# EAGLE design HexTo7seg (EAGLE 9.6.2)
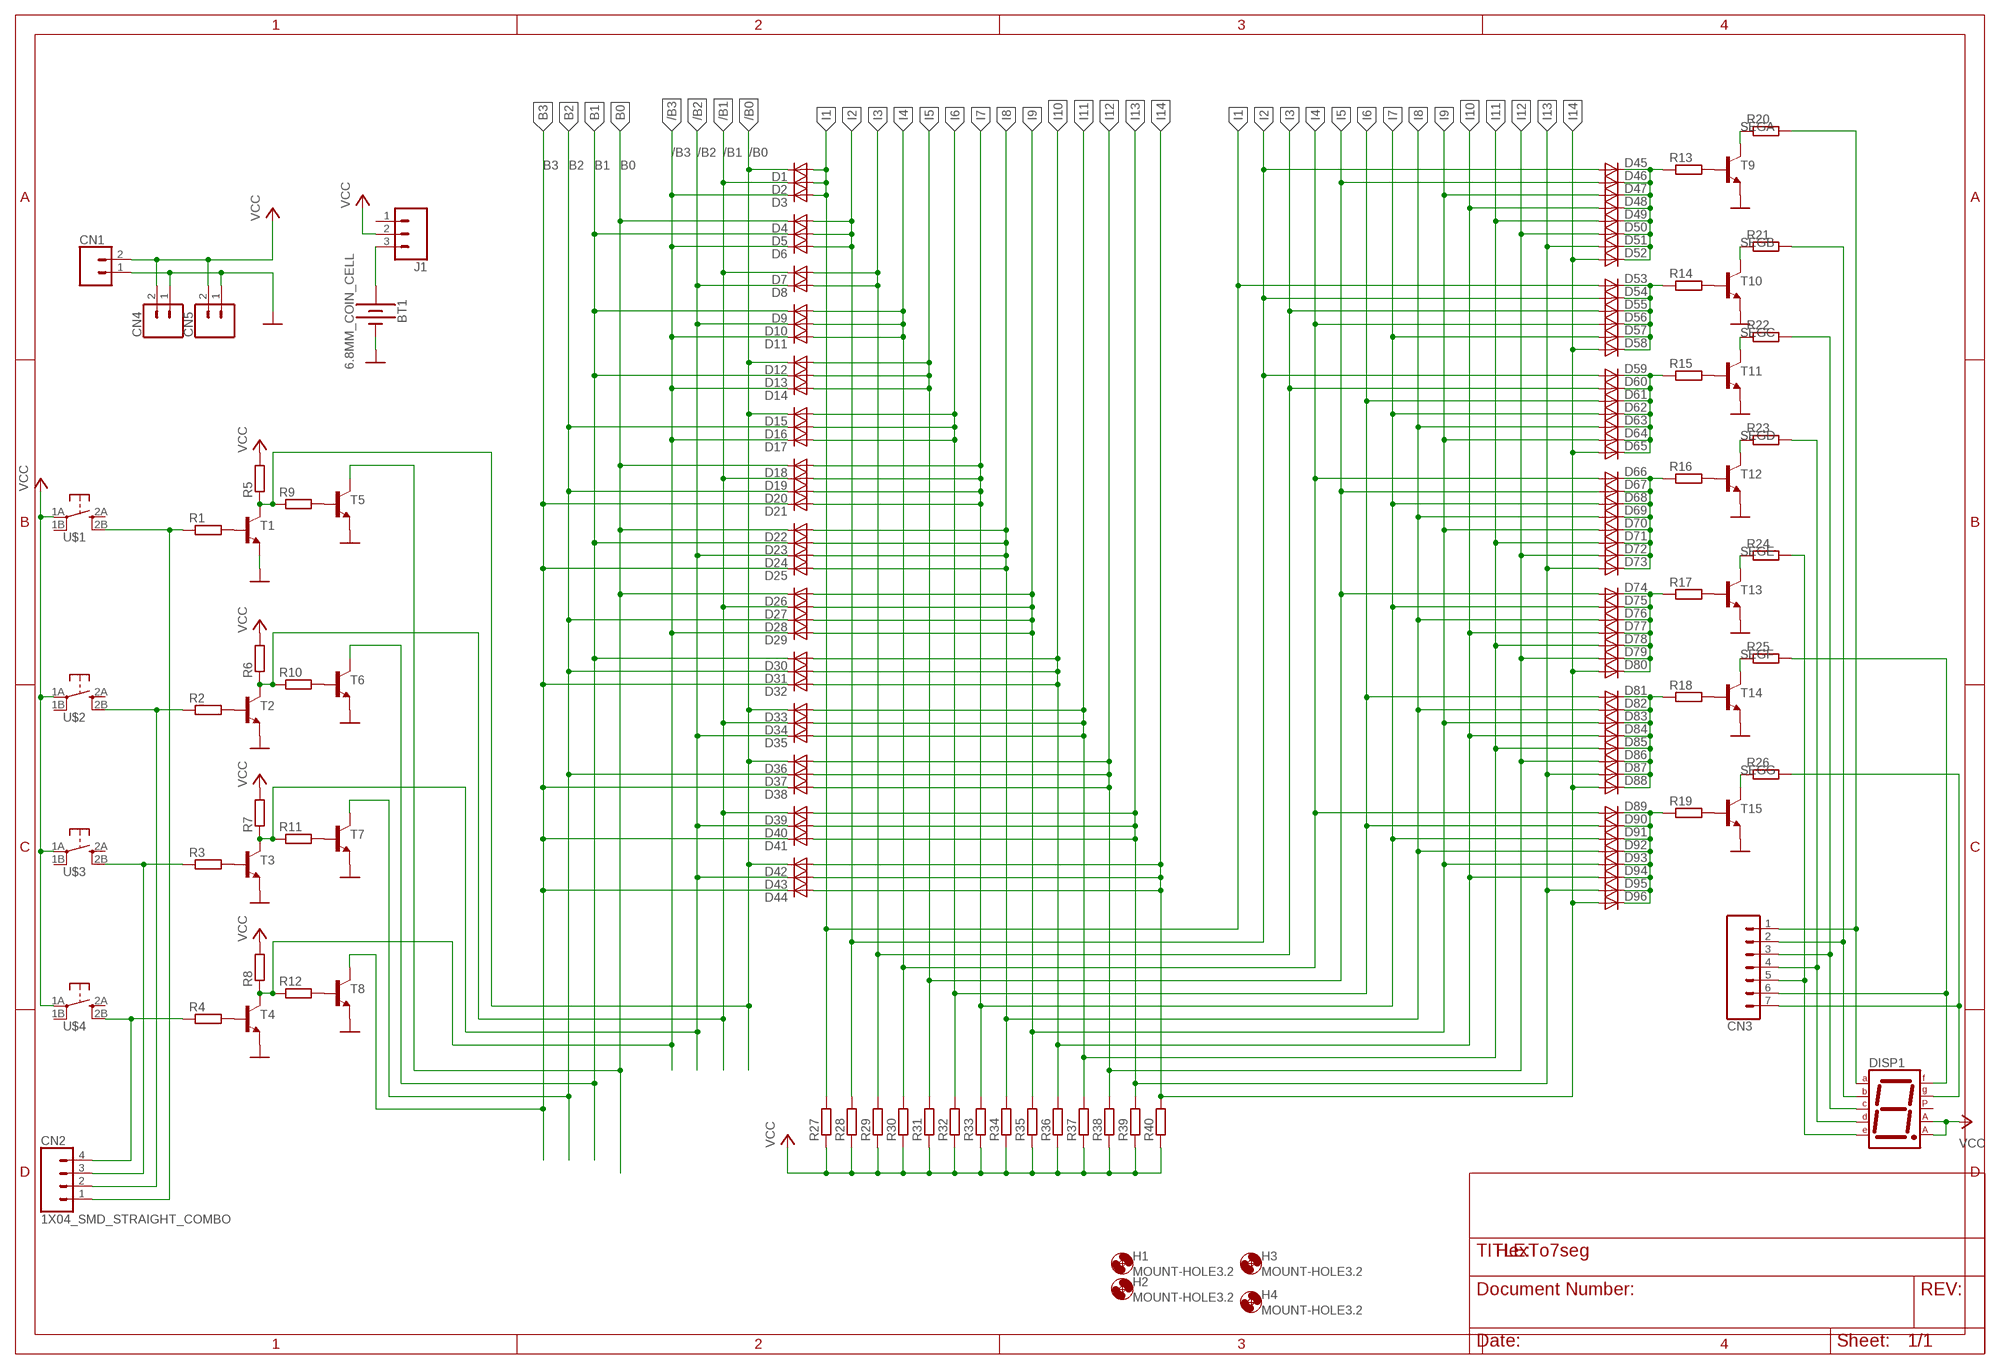
[diagram p0: schematic, sheet 1]

## Parts
BT1  6.8MM_COIN_CELL  BATTERY-20MM_PTH  [BATTCOM_20MM_PTH]
CN1  CONN_02  [1X02]
CN2  1X04_SMD_STRAIGHT_COMBO  CONN_04  [1X04]
CN3  CONN_07  [1X07]
CN4  CONN_02  [1X02]
CN5  CONN_02  [1X02]
D1  SMALL_DIODEDO35-7  [DO35-7]
D2  SMALL_DIODEDO35-7  [DO35-7]
D3  SMALL_DIODEDO35-7  [DO35-7]
D4  SMALL_DIODEDO35-7  [DO35-7]
D5  SMALL_DIODEDO35-7  [DO35-7]
D6  SMALL_DIODEDO35-7  [DO35-7]
D7  SMALL_DIODEDO35-7  [DO35-7]
D8  SMALL_DIODEDO35-7  [DO35-7]
D9  SMALL_DIODEDO35-7  [DO35-7]
D10  SMALL_DIODEDO35-7  [DO35-7]
D11  SMALL_DIODEDO35-7  [DO35-7]
D12  SMALL_DIODEDO35-7  [DO35-7]
D13  SMALL_DIODEDO35-7  [DO35-7]
D14  SMALL_DIODEDO35-7  [DO35-7]
D15  SMALL_DIODEDO35-7  [DO35-7]
D16  SMALL_DIODEDO35-7  [DO35-7]
D17  SMALL_DIODEDO35-7  [DO35-7]
D18  SMALL_DIODEDO35-7  [DO35-7]
D19  SMALL_DIODEDO35-7  [DO35-7]
D20  SMALL_DIODEDO35-7  [DO35-7]
D21  SMALL_DIODEDO35-7  [DO35-7]
D22  SMALL_DIODEDO35-7  [DO35-7]
D23  SMALL_DIODEDO35-7  [DO35-7]
D24  SMALL_DIODEDO35-7  [DO35-7]
D25  SMALL_DIODEDO35-7  [DO35-7]
D26  SMALL_DIODEDO35-7  [DO35-7]
D27  SMALL_DIODEDO35-7  [DO35-7]
D28  SMALL_DIODEDO35-7  [DO35-7]
D29  SMALL_DIODEDO35-7  [DO35-7]
D30  SMALL_DIODEDO35-7  [DO35-7]
D31  SMALL_DIODEDO35-7  [DO35-7]
D32  SMALL_DIODEDO35-7  [DO35-7]
D33  SMALL_DIODEDO35-7  [DO35-7]
D34  SMALL_DIODEDO35-7  [DO35-7]
D35  SMALL_DIODEDO35-7  [DO35-7]
D36  SMALL_DIODEDO35-7  [DO35-7]
D37  SMALL_DIODEDO35-7  [DO35-7]
D38  SMALL_DIODEDO35-7  [DO35-7]
D39  SMALL_DIODEDO35-7  [DO35-7]
D40  SMALL_DIODEDO35-7  [DO35-7]
D41  SMALL_DIODEDO35-7  [DO35-7]
D42  SMALL_DIODEDO35-7  [DO35-7]
D43  SMALL_DIODEDO35-7  [DO35-7]
D44  SMALL_DIODEDO35-7  [DO35-7]
D45  SMALL_DIODEDO35-7  [DO35-7]
D46  SMALL_DIODEDO35-7  [DO35-7]
D47  SMALL_DIODEDO35-7  [DO35-7]
D48  SMALL_DIODEDO35-7  [DO35-7]
D49  SMALL_DIODEDO35-7  [DO35-7]
D50  SMALL_DIODEDO35-7  [DO35-7]
D51  SMALL_DIODEDO35-7  [DO35-7]
D52  SMALL_DIODEDO35-7  [DO35-7]
D53  SMALL_DIODEDO35-7  [DO35-7]
D54  SMALL_DIODEDO35-7  [DO35-7]
D55  SMALL_DIODEDO35-7  [DO35-7]
D56  SMALL_DIODEDO35-7  [DO35-7]
D57  SMALL_DIODEDO35-7  [DO35-7]
D58  SMALL_DIODEDO35-7  [DO35-7]
D59  SMALL_DIODEDO35-7  [DO35-7]
D60  SMALL_DIODEDO35-7  [DO35-7]
D61  SMALL_DIODEDO35-7  [DO35-7]
D62  SMALL_DIODEDO35-7  [DO35-7]
D63  SMALL_DIODEDO35-7  [DO35-7]
D64  SMALL_DIODEDO35-7  [DO35-7]
D65  SMALL_DIODEDO35-7  [DO35-7]
D66  SMALL_DIODEDO35-7  [DO35-7]
D67  SMALL_DIODEDO35-7  [DO35-7]
D68  SMALL_DIODEDO35-7  [DO35-7]
D69  SMALL_DIODEDO35-7  [DO35-7]
D70  SMALL_DIODEDO35-7  [DO35-7]
D71  SMALL_DIODEDO35-7  [DO35-7]
D72  SMALL_DIODEDO35-7  [DO35-7]
D73  SMALL_DIODEDO35-7  [DO35-7]
D74  SMALL_DIODEDO35-7  [DO35-7]
D75  SMALL_DIODEDO35-7  [DO35-7]
D76  SMALL_DIODEDO35-7  [DO35-7]
D77  SMALL_DIODEDO35-7  [DO35-7]
D78  SMALL_DIODEDO35-7  [DO35-7]
D79  SMALL_DIODEDO35-7  [DO35-7]
D80  SMALL_DIODEDO35-7  [DO35-7]
D81  SMALL_DIODEDO35-7  [DO35-7]
D82  SMALL_DIODEDO35-7  [DO35-7]
D83  SMALL_DIODEDO35-7  [DO35-7]
D84  SMALL_DIODEDO35-7  [DO35-7]
D85  SMALL_DIODEDO35-7  [DO35-7]
D86  SMALL_DIODEDO35-7  [DO35-7]
D87  SMALL_DIODEDO35-7  [DO35-7]
D88  SMALL_DIODEDO35-7  [DO35-7]
D89  SMALL_DIODEDO35-7  [DO35-7]
D90  SMALL_DIODEDO35-7  [DO35-7]
D91  SMALL_DIODEDO35-7  [DO35-7]
D92  SMALL_DIODEDO35-7  [DO35-7]
D93  SMALL_DIODEDO35-7  [DO35-7]
D94  SMALL_DIODEDO35-7  [DO35-7]
D95  SMALL_DIODEDO35-7  [DO35-7]
D96  SMALL_DIODEDO35-7  [DO35-7]
DISP1  7SEG-CA  [7SEG-13]
H1  MOUNT-HOLE3.2  [3,2]
H2  MOUNT-HOLE3.2  [3,2]
H3  MOUNT-HOLE3.2  [3,2]
H4  MOUNT-HOLE3.2  [3,2]
J1  CONN_03NP  [1X03NOSTOP]
R1  RESISTOR7MM  [7MM_RESISTOR]
R2  RESISTOR7MM  [7MM_RESISTOR]
R3  RESISTOR7MM  [7MM_RESISTOR]
R4  RESISTOR7MM  [7MM_RESISTOR]
R5  RESISTOR7MM  [7MM_RESISTOR]
R6  RESISTOR7MM  [7MM_RESISTOR]
R7  RESISTOR7MM  [7MM_RESISTOR]
R8  RESISTOR7MM  [7MM_RESISTOR]
R9  RESISTOR7MM  [7MM_RESISTOR]
R10  RESISTOR7MM  [7MM_RESISTOR]
R11  RESISTOR7MM  [7MM_RESISTOR]
R12  RESISTOR7MM  [7MM_RESISTOR]
R13  RESISTOR7MM  [7MM_RESISTOR]
R14  RESISTOR7MM  [7MM_RESISTOR]
R15  RESISTOR7MM  [7MM_RESISTOR]
R16  RESISTOR7MM  [7MM_RESISTOR]
R17  RESISTOR7MM  [7MM_RESISTOR]
R18  RESISTOR7MM  [7MM_RESISTOR]
R19  RESISTOR7MM  [7MM_RESISTOR]
R20  RESISTOR7MM  [7MM_RESISTOR]
R21  RESISTOR7MM  [7MM_RESISTOR]
R22  RESISTOR7MM  [7MM_RESISTOR]
R23  RESISTOR7MM  [7MM_RESISTOR]
R24  RESISTOR7MM  [7MM_RESISTOR]
R25  RESISTOR7MM  [7MM_RESISTOR]
R26  RESISTOR7MM  [7MM_RESISTOR]
R27  RESISTOR7MM  [7MM_RESISTOR]
R28  RESISTOR7MM  [7MM_RESISTOR]
R29  RESISTOR7MM  [7MM_RESISTOR]
R30  RESISTOR7MM  [7MM_RESISTOR]
R31  RESISTOR7MM  [7MM_RESISTOR]
R32  RESISTOR7MM  [7MM_RESISTOR]
R33  RESISTOR7MM  [7MM_RESISTOR]
R34  RESISTOR7MM  [7MM_RESISTOR]
R35  RESISTOR7MM  [7MM_RESISTOR]
R36  RESISTOR7MM  [7MM_RESISTOR]
R37  RESISTOR7MM  [7MM_RESISTOR]
R38  RESISTOR7MM  [7MM_RESISTOR]
R39  RESISTOR7MM  [7MM_RESISTOR]
R40  RESISTOR7MM  [7MM_RESISTOR]
T1  BC547B-NPN-TO92-CBE  [TO92-CBE]
T2  BC547B-NPN-TO92-CBE  [TO92-CBE]
T3  BC547B-NPN-TO92-CBE  [TO92-CBE]
T4  BC547B-NPN-TO92-CBE  [TO92-CBE]
T5  BC547B-NPN-TO92-CBE  [TO92-CBE]
T6  BC547B-NPN-TO92-CBE  [TO92-CBE]
T7  BC547B-NPN-TO92-CBE  [TO92-CBE]
T8  BC547B-NPN-TO92-CBE  [TO92-CBE]
T9  BC547B-NPN-TO92-CBE  [TO92-CBE]
T10  BC547B-NPN-TO92-CBE  [TO92-CBE]
T11  BC547B-NPN-TO92-CBE  [TO92-CBE]
T12  BC547B-NPN-TO92-CBE  [TO92-CBE]
T13  BC547B-NPN-TO92-CBE  [TO92-CBE]
T14  BC547B-NPN-TO92-CBE  [TO92-CBE]
T15  BC547B-NPN-TO92-CBE  [TO92-CBE]
U$1  TACTILETACT-6X6-PTH  [TACTILE-PTH]
U$2  TACTILETACT-6X6-PTH  [TACTILE-PTH]
U$3  TACTILETACT-6X6-PTH  [TACTILE-PTH]
U$4  TACTILETACT-6X6-PTH  [TACTILE-PTH]

## Nets
/B0: D1.C D12.C D15.C D33.C D36.C D42.C R5.1 R9.1 T1.C
/B1: D2.C D7.C D19.C D27.C D34.C D39.C R6.1 R10.1 T2.C
/B2: D8.C D10.C D24.C D35.C D40.C D43.C R7.1 R11.1 T3.C
/B3: D3.C D6.C D11.C D14.C D17.C D29.C R8.1 R12.1 T4.C
B0: D4.C D18.C D22.C D26.C T5.C
B1: D5.C D9.C D13.C D23.C D30.C T6.C
B2: D16.C D20.C D28.C D31.C D37.C T7.C
B3: D21.C D25.C D32.C D38.C D41.C D44.C T8.C
GND [PWR]: BT1.2(-) CN1.1 CN4.1 CN5.1 T1.E T2.E T3.E T4.E T5.E T6.E T7.E T8.E T9.E T10.E T11.E T12.E T13.E T14.E T15.E
I1: D1.A D2.A D3.A D53.A R27.2
I2: D4.A D5.A D6.A D45.A D54.A D59.A R28.2
I3: D7.A D8.A D55.A D60.A R29.2
I4: D9.A D10.A D11.A D56.A D66.A D89.A R30.2
I5: D12.A D13.A D14.A D46.A D67.A D74.A R31.2
I6: D15.A D16.A D17.A D61.A D81.A D90.A R32.2
I7: D18.A D19.A D20.A D21.A D57.A D62.A D68.A D75.A D91.A R33.2
I8: D22.A D23.A D24.A D25.A D63.A D69.A D76.A D82.A D92.A R34.2
I9: D26.A D27.A D28.A D29.A D47.A D64.A D70.A D83.A D93.A R35.2
I10: D30.A D31.A D32.A D48.A D77.A D84.A D94.A R36.2
I11: D33.A D34.A D35.A D49.A D71.A D78.A D85.A R37.2
I12: D36.A D37.A D38.A D50.A D72.A D79.A D86.A R38.2
I13: D39.A D40.A D41.A D51.A D73.A D87.A D95.A R39.2
I14: D42.A D43.A D44.A D52.A D58.A D65.A D80.A D88.A D96.A R40.2
IN0: CN2.1 R1.1 U$1.2B
IN1: CN2.2 R2.1 U$2.2B
IN2: CN2.3 R3.1 U$3.2B
IN3: CN2.4 R4.1 U$4.2B
N$1: R13.2 T9.B
N$2: CN3.1 DISP1.7(A) R20.2
N$3: R14.2 T10.B
N$4: R15.2 T11.B
N$5: R16.2 T12.B
N$6: R17.2 T13.B
N$7: R18.2 T14.B
N$8: R19.2 T15.B
N$9: CN3.2 DISP1.6(B) R21.2
N$10: CN3.3 DISP1.4(C) R22.2
N$11: CN3.4 DISP1.2(D) R23.2
N$12: CN3.5 DISP1.1(E) R24.2
N$13: CN3.6 DISP1.9(F) R25.2
N$14: CN3.7 DISP1.10(G) R26.2
N$16 [PWR]: BT1.1(+) J1.3
N$22: R1.2 T1.B
N$23: R2.2 T2.B
N$24: R3.2 T3.B
N$25: R4.2 T4.B
N$26: R12.2 T8.B
N$27: R11.2 T7.B
N$28: R10.2 T6.B
N$29: R9.2 T5.B
ORA: D45.C D46.C D47.C D48.C D49.C D50.C D51.C D52.C R13.1
ORB: D53.C D54.C D55.C D56.C D57.C D58.C R14.1
ORC: D59.C D60.C D61.C D62.C D63.C D64.C D65.C R15.1
ORD: D66.C D67.C D68.C D69.C D70.C D71.C D72.C D73.C R16.1
ORE: D74.C D75.C D76.C D77.C D78.C D79.C D80.C R17.1
ORF: D81.C D82.C D83.C D84.C D85.C D86.C D87.C D88.C R18.1
ORG: D89.C D90.C D91.C D92.C D93.C D94.C D95.C D96.C R19.1
SEGA: R20.1 T9.C
SEGB: R21.1 T10.C
SEGC: R22.1 T11.C
SEGD: R23.1 T12.C
SEGE: R24.1 T13.C
SEGF: R25.1 T14.C
SEGG: R26.1 T15.C
VCC [PWR]: CN1.2 CN4.2 CN5.2 DISP1.3(CA1) DISP1.8(CA2) J1.2 R5.2 R6.2 R7.2 R8.2 R27.1 R28.1 R29.1 R30.1 R31.1 R32.1 R33.1 R34.1 R35.1 R36.1 R37.1 R38.1 R39.1 R40.1 U$1.1A U$2.1A U$3.1A U$4.1A
Unconnected: DISP1.5(DP) J1.1 U$1.1B U$1.2A U$2.1B U$2.2A U$3.1B U$3.2A U$4.1B U$4.2A

## Library data of the parts
BT1 = MatsEng:BATTERY: Battery - Single Cell A variety of battery chemistries, sizes, and footprints. Device List: 20MM_PTH - Coin Cell Battery Holder - 20mm (PTH) <https://www.sparkfun.com/products/783> 6.8MM_PTH - Coin Cell Battery Holder - 6.8MM(SMD) <https://www.digikey.com/product-detail/en/seiko-instruments/MS621FE-FL11E/728-1057-ND/1889208?WT.srch=1&gclid=CNOQ5a6LzdQCFZS2wAodXCkE0g> 12MM_SMD - Coin Cell Battery Holder - 12mm (SMD) <https://www.sparkfun.com/products/10592> 12MM_PTH - Coin Cell Battery Holder - 12mm (PTH) <https://www.sparkfun.com/products/7948> 20MM_SMD - 20mm Coin Cell Battery Holder (SMD) (2 legs) Used on the Big Time Watch Kit <https://www.sparkfun.com/products/11734> 20MM_SMD_4LEGS - Coin Cell Battery Holder - 20mm (SMD) <https://www.sparkfun.com/products/11892> 20MM_SMD_4LEGS_OVERPASTE - Coin Cell Battery Holder - 20mm (SMD) <https://www.sparkfun.com/products/11892> (Over-paste on the legs) 24.5MM_PTH - Coin Cell Battery Holder - 24.5mm (PTH) <https://www.sparkfun.com/products/8863> 9V - 9V Battery Holder - PC Mount Used on the SparkFun SparkPunk Sound Kit <https://www.sparkfun.com/products/11177> and SparkFun SparkPunk Sequencer Kit <https://www.sparkfun.com/products/12707> 18650 - Battery Holder - 18650 (PTH) <https://www.sparkfun.com/products/13113> AA - Battery Holder - 1xAA (PTH) <https://www.sparkfun.com/products/7949> AAA - Battery Holder - 1xAAA (PTH) <https://www.sparkfun.com/products/12718> AA_KIT - Battery Holder - 1xAA (PTH) <https://www.sparkfun.com/products/7949> Special kit package - pads only have exposed copper on one side of the board. AAA_KIT - Battery Holder - 1xAAA (PTH) <https://www.sparkfun.com/products/12718> Special kit package - pads only have exposed copper on one side of the board.; PROD_ID: BATT-08316; SF_SKU: PRT-07949
CN1 CN4 CN5 = MatsEng:CONN_02: Multi connection point. Often used as Generic Header-pin footprint for 0.1 inch spaced/style header connections On any of the 0.1 inch spaced packages, you can populate with these: Break Away Headers - Straight <https://www.sparkfun.com/products/116> (PRT-00116) Break Away Male Headers - Right Angle <https://www.sparkfun.com/products/553> (PRT-00553) Female Headers <https://www.sparkfun.com/products/115> (PRT-00115) Break Away Headers - Machine Pin <https://www.sparkfun.com/products/117> (PRT-00117) Break Away Female Headers - Swiss Machine Pin <https://www.sparkfun.com/products/743> (PRT-00743) For SCREWTERMINALS and SPRING TERMINALS visit here: Screw Terimnals on SparkFun.com <https://www.sparkfun.com/search/results?term=Screw+Terminals> (5mm/3.5mm/2.54mm spacing) This device is also useful as a general connection point to wire up your design to another part of your project. Our various solder wires solder well into these plated through hole pads. Hook-Up Wire - Assortment (Stranded, 22 AWG) <https://www.sparkfun.com/products/11375> (PRT-11375) Hook-Up Wire - Assortment (Solid Core, 22 AWG) <https://www.sparkfun.com/products/11367> (PRT-11367) View the entire wire category on our website here <https://www.sparkfun.com/categories/141> Special notes: Molex polarized connector foot print use with: PRT-08233 with associated crimp pins and housings. 2.54_SCREWTERM for use with PRT-10571. 3.5mm Screw Terminal footprints for PRT-08084 5mm Screw Terminal footprints for use with PRT-08432; PROD_ID: CONN-13512; SF_ID: PRT-09918; SF_SKU: PRT-08432; SKU: PRT-09914
CN2 = MatsEng:CONN_04: Multi connection point. Often used as Generic Header-pin footprint for 0.1 inch spaced/style header connections On any of the 0.1 inch spaced packages, you can populate with these: Break Away Headers - Straight <https://www.sparkfun.com/products/116> (PRT-00116) Break Away Male Headers - Right Angle <https://www.sparkfun.com/products/553> (PRT-00553) Female Headers <https://www.sparkfun.com/products/115> (PRT-00115) Break Away Headers - Machine Pin <https://www.sparkfun.com/products/117> (PRT-00117) Break Away Female Headers - Swiss Machine Pin <https://www.sparkfun.com/products/743> (PRT-00743) For SCREWTERMINALS and SPRING TERMINALS visit here: Screw Terimnals on SparkFun.com <https://www.sparkfun.com/search/results?term=Screw+Terminals> (5mm/3.5mm/2.54mm spacing) This device is also useful as a general connection point to wire up your design to another part of your project. Our various solder wires solder well into these plated through hole pads. Hook-Up Wire - Assortment (Stranded, 22 AWG) <https://www.sparkfun.com/products/11375> (PRT-11375) Hook-Up Wire - Assortment (Solid Core, 22 AWG) <https://www.sparkfun.com/products/11367> (PRT-11367) View the entire wire category on our website here <https://www.sparkfun.com/categories/141> Special notes: Molex polarized connector foot print use with SKU : PRT-08231 with associated crimp pins and housings. 1MM SMD Version SKU: PRT-10208; PROD_ID: CONN-08511; SF_ID: PRT-12638
CN3 = MatsEng:CONN_07: Multi connection point. Often used as Generic Header-pin footprint for 0.1 inch spaced/style header connections On any of the 0.1 inch spaced packages, you can populate with these: Break Away Headers - Straight <https://www.sparkfun.com/products/116> (PRT-00116) Break Away Male Headers - Right Angle <https://www.sparkfun.com/products/553> (PRT-00553) Female Headers <https://www.sparkfun.com/products/115> (PRT-00115) Break Away Headers - Machine Pin <https://www.sparkfun.com/products/117> (PRT-00117) Break Away Female Headers - Swiss Machine Pin <https://www.sparkfun.com/products/743> (PRT-00743) For SCREWTERMINALS and SPRING TERMINALS visit here: Screw Terimnals on SparkFun.com <https://www.sparkfun.com/search/results?term=Screw+Terminals> (5mm/3.5mm/2.54mm spacing) This device is also useful as a general connection point to wire up your design to another part of your project. Our various solder wires solder well into these plated through hole pads. Hook-Up Wire - Assortment (Stranded, 22 AWG) <https://www.sparkfun.com/products/11375> (PRT-11375) Hook-Up Wire - Assortment (Solid Core, 22 AWG) <https://www.sparkfun.com/products/11367> (PRT-11367) View the entire wire category on our website here <https://www.sparkfun.com/categories/141> Special notes: Molex polarized connector foot print use with SKU : PRT-08231 with associated crimp pins and housings. 1MM SMD Version SKU: PRT-10208 NOTES ON THE VARIANTS LOCK and LOCK_LONGPADS... This footprint was designed to help hold the alignment of a through-hole component (i.e. 6-pin header) while soldering it into place. You may notice that each hole has been shifted either up or down by 0.005 of an inch from it's more standard position (which is a perfectly straight line). This slight alteration caused the pins (the squares in the middle) to touch the edges of the holes. Because they are alternating, it causes a "brace" to hold the component in place. 0.005 has proven to be the perfect amount of "off-center" position when using our standard breakaway headers. Although looks a little odd when you look at the bare footprint, once you have a header in there, the alteration is very hard to notice. Also,if you push a header all the way into place, it is covered up entirely on the bottom side.
D1-D96 = MatsEng:SMALL_DIODE: Small Signal Diode
DISP1 = MatsEng:7SEG-CA: 7-segment DISPLAY single anode, 13 mm
H1-H4 = MatsEng:MOUNT-HOLE: MOUNTING HOLE with drill center marker
J1 = MatsEng:CONN_03: Multi connection point. Often used as Generic Header-pin footprint for 0.1 inch spaced/style header connections On any of the 0.1 inch spaced packages, you can populate with these: Break Away Headers - Straight <https://www.sparkfun.com/products/116> (PRT-00116) Break Away Male Headers - Right Angle <https://www.sparkfun.com/products/553> (PRT-00553) Female Headers <https://www.sparkfun.com/products/115> (PRT-00115) Break Away Headers - Machine Pin <https://www.sparkfun.com/products/117> (PRT-00117) Break Away Female Headers - Swiss Machine Pin <https://www.sparkfun.com/products/743> (PRT-00743) For SCREWTERMINALS and SPRING TERMINALS visit here: Screw Terimnals on SparkFun.com <https://www.sparkfun.com/search/results?term=Screw+Terminals> (5mm/3.5mm/2.54mm spacing) This device is also useful as a general connection point to wire up your design to another part of your project. Our various solder wires solder well into these plated through hole pads. Hook-Up Wire - Assortment (Stranded, 22 AWG) <https://www.sparkfun.com/products/11375> (PRT-11375) Hook-Up Wire - Assortment (Solid Core, 22 AWG) <https://www.sparkfun.com/products/11367> (PRT-11367) View the entire wire category on our website here <https://www.sparkfun.com/categories/141> Special notes: Molex polarized connector foot print use with SKU : PRT-08231 with associated crimp pins and housings. 1MM SMD Version SKU: PRT-10208
R1-R40 = MatsEng:RESISTOR: Standard resistor, various versions
T1-T15 = MatsEng:*-NPN-: NPN Transistror BF959 corrected 2008.03.06
U$1-U$4 = MatsEng:TACTILE

## Net classes
0 default: width 0.305 mm, drill 0.4 mm, clearance 0.203 mm
1 PWR: width 0.61 mm, drill 0.4 mm, clearance 0.203 mm

## Board
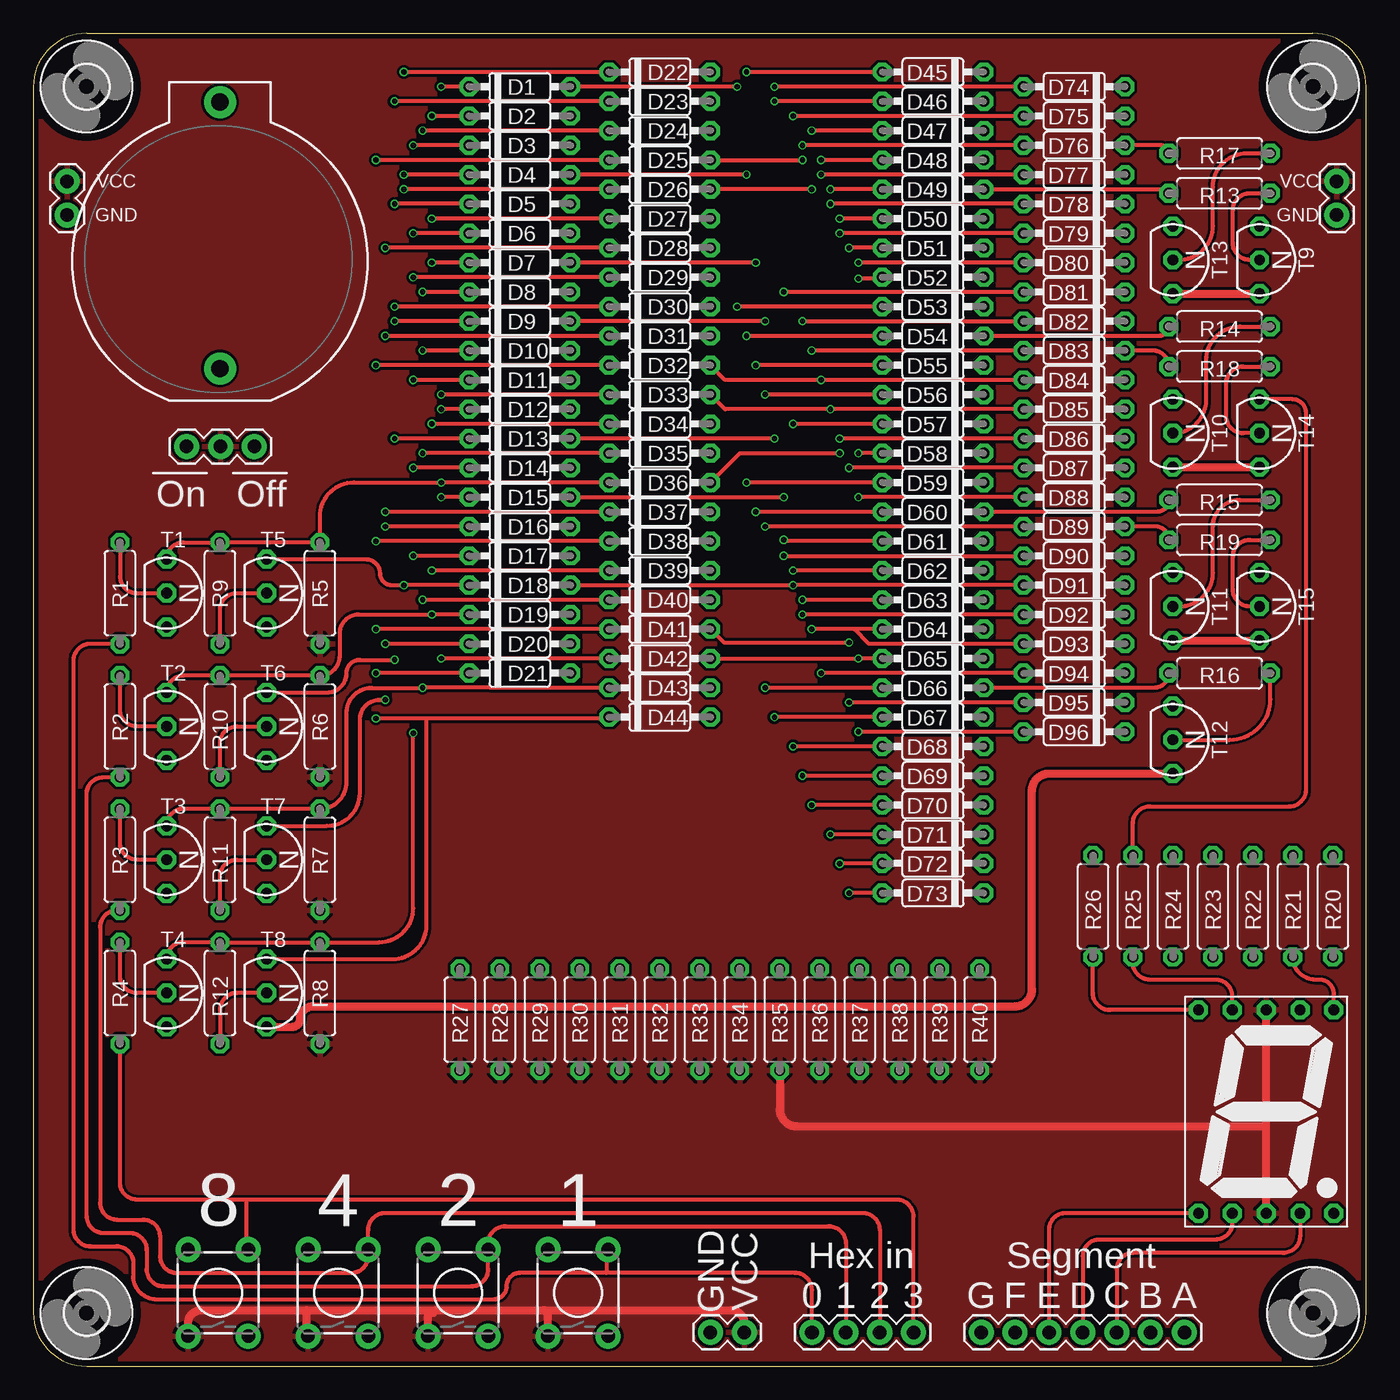
[diagram p1: board, top side]
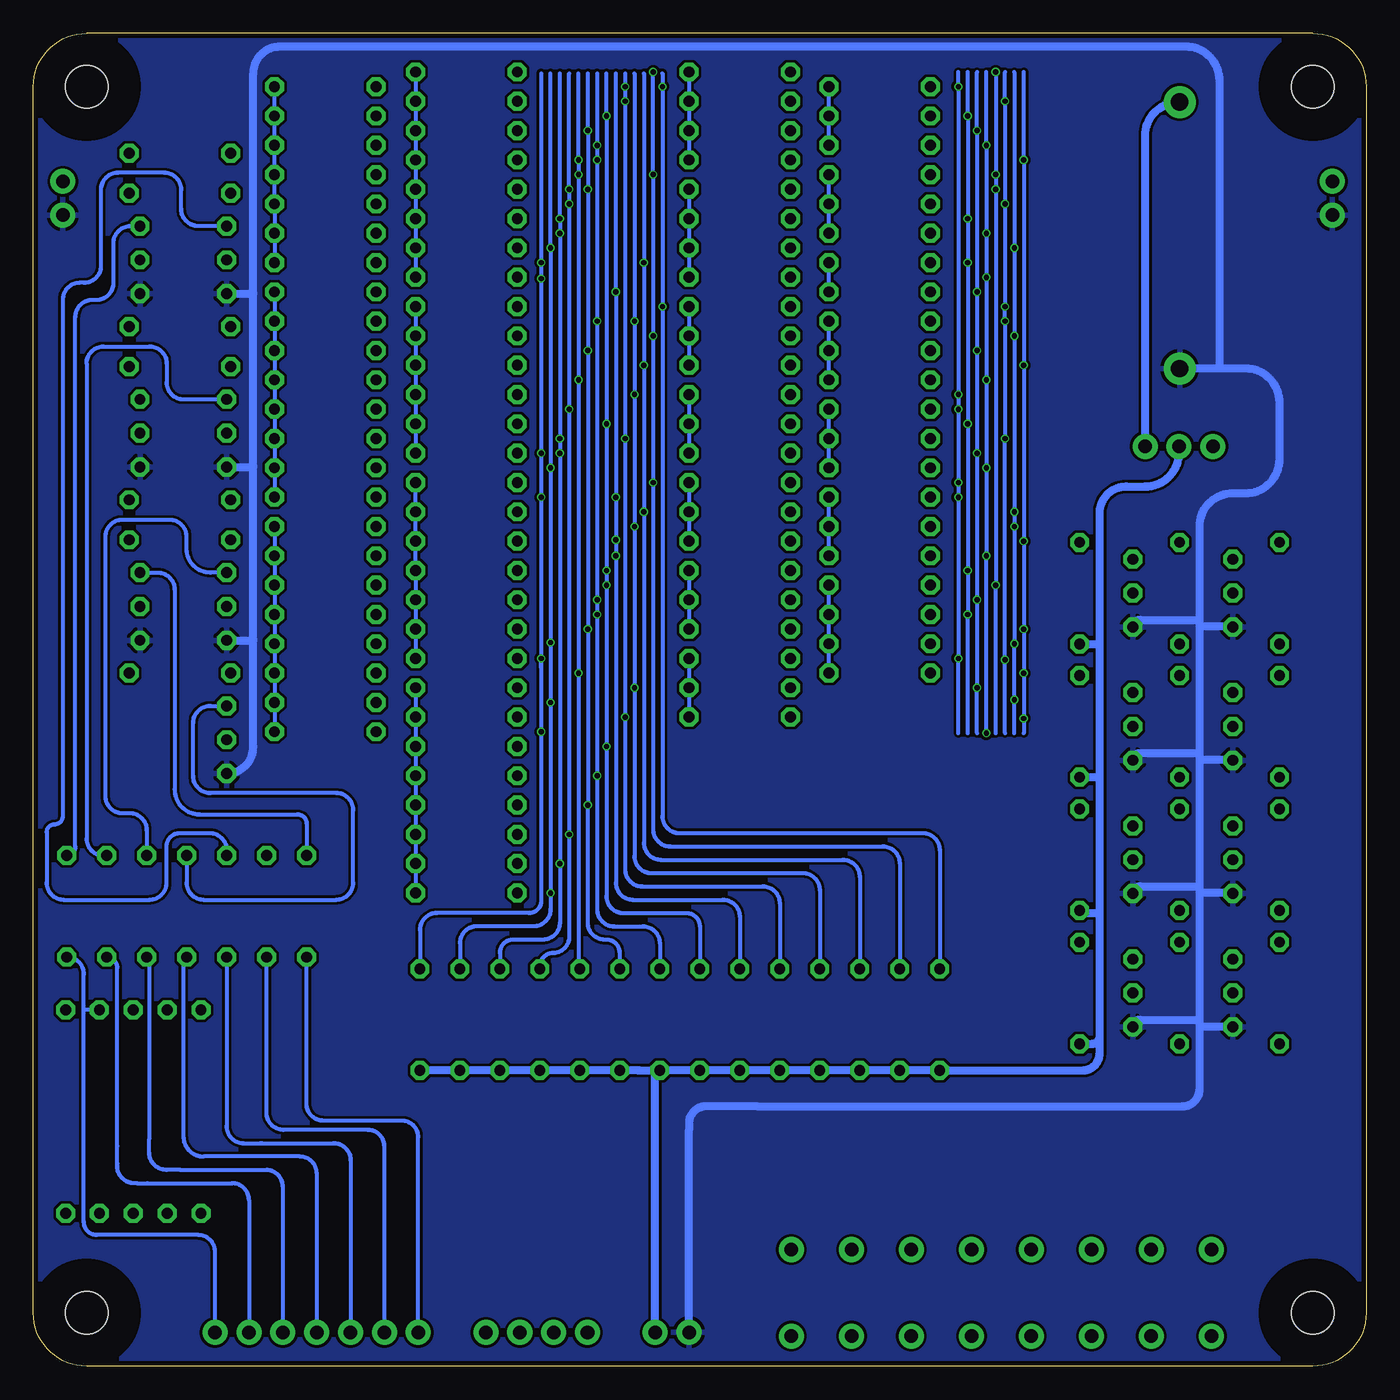
[diagram p2: board, bottom side, seen from below]

Size 100 x 100 mm. Coordinates in mm from the lower left corner, seen from the top.
Outline: 4,0 96,0 arc90 100,4 100,96 arc90 96,100 4,100 arc90 0,96 0,4 arc90 4,0
Copper layers (1*2*15*16): Top 0.035559375mm / dielectric 0.17018125mm / Route2 0.01778125mm / dielectric 47mil / Route15 0.01778125mm / dielectric 0.17018125mm / Bottom 0.035559375mm
Design rules "oshpark-4layer": minimum track width 5mil, minimum drill 10mil, track to track 5mil, track to pad 5mil, pad to pad 5mil, via to via 5mil, smd to smd 5mil, copper to edge 15mil, drill to drill 6mil, minimum pad ring 4mil, minimum via ring 4mil, stop-mask expansion 2.5mil, vias tented up to drill 0mil, thermal gap 10mil

### Footprints (pad centres in the part's own frame; a part is rotated, then mirrored left to right if it is on the bottom)
BATTCOM_20MM_PTH = drill 1.3 pad 2.4: 1 11.85,0; 2 -8.15,0
1X02 = drill 1.016 pad 1.88: 1 0,0; 2 2.54,0
1X04 = drill 1.016 pad 1.88: 1 0,0; 2 2.54,0; 3 5.08,0; 4 7.62,0
1X07 = drill 1.016 pad 1.88: 1 0,0; 2 2.54,0; 3 5.08,0; 4 7.62,0; 5 10.16,0; 6 12.7,0; 7 15.24,0
DO35-7 = drill 0.813 pad 1.422 octagon: A 3.81,0; C -3.81,0
7SEG-13 = drill 0.813 pad 1.422 octagon: 1 -5.08,-7.62; 2 -2.54,-7.62; 3 0,-7.62; 4 2.54,-7.62; 5 5.08,-7.62; 6 5.08,7.62; 7 2.54,7.62; 8 0,7.62; 9 -2.54,7.62; 10 -5.08,7.62
3,2 = hole 3.2: 0,0
1X03NOSTOP = drill 1.016 pad 1.88: 1 0,0; 2 2.54,0; 3 5.08,0
7MM_RESISTOR = drill 0.813 pad 1.422 octagon: 1 -3.81,0; 2 3.81,0
TO92-CBE = drill 0.813 pad 1.422 octagon: B 0,0; C -2.54,0; E 2.54,0
TACTILE-PTH = drill 1.016 pad 1.88: 1A -3.251,2.261; 1B 3.251,2.261; 2A -3.251,-2.261; 2B 3.251,-2.261

### Placement (x,y rotation side)
BT1  14,83 90 top
CN1  50.8,2.54 0 top
CN2  58.42,2.54 0 top
CN3  86.36,2.54 180 top
CN4  2.54,86.36 90 top
CN5  97.79,86.36 90 top
D1  36.5,96 0 top
D2  36.5,93.8 0 top
D3  36.5,91.6 0 top
D4  36.5,89.4 0 top
D5  36.5,87.2 0 top
D6  36.5,85 0 top
D7  36.5,82.8 0 top
D8  36.5,80.6 0 top
D9  36.5,78.4 0 top
D10  36.5,76.2 0 top
D11  36.5,74 0 top
D12  36.5,71.8 0 top
D13  36.5,69.6 0 top
D14  36.5,67.4 0 top
D15  36.5,65.2 0 top
D16  36.5,63 0 top
D17  36.5,60.8 0 top
D18  36.5,58.6 0 top
D19  36.5,56.4 0 top
D20  36.5,54.2 0 top
D21  36.5,52 0 top
D22  47,97.1 0 top
D23  47,94.9 0 top
D24  47,92.7 0 top
D25  47,90.5 0 top
D26  47,88.3 0 top
D27  47,86.1 0 top
D28  47,83.9 0 top
D29  47,81.7 0 top
D30  47,79.5 0 top
D31  47,77.3 0 top
D32  47,75.1 0 top
D33  47,72.9 0 top
D34  47,70.7 0 top
D35  47,68.5 0 top
D36  47,66.3 0 top
D37  47,64.1 0 top
D38  47,61.9 0 top
D39  47,59.7 0 top
D40  47,57.5 0 top
D41  47,55.3 0 top
D42  47,53.1 0 top
D43  47,50.9 0 top
D44  47,48.7 0 top
D45  67.5,97.1 180 top
D46  67.5,94.9 180 top
D47  67.5,92.7 180 top
D48  67.5,90.5 180 top
D49  67.5,88.3 180 top
D50  67.5,86.1 180 top
D51  67.5,83.9 180 top
D52  67.5,81.7 180 top
D53  67.5,79.5 180 top
D54  67.5,77.3 180 top
D55  67.5,75.1 180 top
D56  67.5,72.9 180 top
D57  67.5,70.7 180 top
D58  67.5,68.5 180 top
D59  67.5,66.3 180 top
D60  67.5,64.1 180 top
D61  67.5,61.9 180 top
D62  67.5,59.7 180 top
D63  67.5,57.5 180 top
D64  67.5,55.3 180 top
D65  67.5,53.1 180 top
D66  67.5,50.9 180 top
D67  67.5,48.7 180 top
D68  67.5,46.5 180 top
D69  67.5,44.3 180 top
D70  67.5,42.1 180 top
D71  67.5,39.9 180 top
D72  67.5,37.73 180 top
D73  67.5,35.5 180 top
D74  78.1,96 180 top
D75  78.1,93.8 180 top
D76  78.1,91.6 180 top
D77  78.1,89.4 180 top
D78  78.1,87.2 180 top
D79  78.1,85 180 top
D80  78.1,82.8 180 top
D81  78.1,80.6 180 top
D82  78.1,78.4 180 top
D83  78.1,76.2 180 top
D84  78.1,74 180 top
D85  78.1,71.8 180 top
D86  78.1,69.6 180 top
D87  78.1,67.4 180 top
D88  78.1,65.2 180 top
D89  78.1,63 180 top
D90  78.1,60.8 180 top
D91  78.1,58.6 180 top
D92  78.1,56.4 180 top
D93  78.1,54.2 180 top
D94  78.1,52 180 top
D95  78.1,49.8 180 top
D96  78.1,47.6 180 top
DISP1  92.5,19.1 0 top
H1  4,4 0 top
H2  4,96 0 top
H3  96,96 0 top
H4  96,4 0 top
J1  11.5,69 0 top
R1  6.5,58 90 top
R2  6.5,48 90 top
R3  6.5,38 90 top
R4  6.5,28 90 top
R5  21.5,58 270 top
R6  21.5,48 270 top
R7  21.5,38 270 top
R8  21.5,28 270 top
R9  14,58 270 top
R10  14,48 270 top
R11  14,38 270 top
R12  14,28 270 top
R13  89,88 0 top
R14  89,78 0 top
R15  89,65 0 top
R16  89,52 0 top
R17  89,91 0 top
R18  89,75 0 top
R19  89,62 0 top
R20  97.5,34.5 270 top
R21  94.5,34.5 270 top
R22  91.5,34.5 270 top
R23  88.5,34.5 270 top
R24  85.5,34.5 270 top
R25  82.5,34.5 270 top
R26  79.5,34.5 270 top
R27  32,26 90 top
R28  35,26 90 top
R29  38,26 90 top
R30  41,26 90 top
R31  44,26 90 top
R32  47,26 90 top
R33  50,26 90 top
R34  53,26 90 top
R35  56,26 90 top
R36  59,26 90 top
R37  62,26 90 top
R38  65,26 90 top
R39  68,26 90 top
R40  71,26 90 top
T1  10,58 270 top
T2  10,48 270 top
T3  10,38 270 top
T4  10,28 270 top
T5  17.5,58 270 top
T6  17.5,48 270 top
T7  17.5,38 270 top
T8  17.5,28 270 top
T9  92,83 270 top
T10  85.5,70 270 top
T11  85.5,57 270 top
T12  85.5,47 270 top
T13  85.5,83 270 top
T14  92,70 270 top
T15  92,57 270 top
U$1  40.87,5.5 90 top
U$2  31.87,5.5 90 top
U$3  22.87,5.5 90 top
U$4  13.87,5.5 90 top

### Tracks (layer width: path | path; a pad name or v marks a point on that pad's centre or on a via)
/B0  (via drill 0.4)
  Top 0.305: D1.C v30.6,96 | D12.C v30.6,71.8 | D15.C v30.6,65.2 | D33.C v30.6,72.9 | D36.C v30.6,66.3 24.04,66.3 arc90 21.5,63.76 R5.1 R9.1 11.27,61.81 arc90 T1.C | D42.C 37.69,53.1 | 37.69,53.1 | 37.69,53.1 v30.6,53.1
  Bottom 0.305: 30.6,47.5 v30.6,53.1 v30.6,65.2 v30.6,66.3 v30.6,71.8 v30.6,72.9 v30.6,96 30.6,97.1
/B1  (via drill 0.4)
  Top 0.305: D2.C v29.9,93.8 | D7.C v29.9,82.8 | D19.C v29.9,56.4 24.4,56.4 arc90 23,55 23,53.31 arc-90 R6.1 R10.1 11.27,51.81 arc90 T2.C | D27.C v29.9,86.1 | D34.C v29.9,70.7 | D39.C v29.9,59.7
  Bottom 0.305: 29.9,47.5 v29.9,56.4 v29.9,59.7 v29.9,70.7 v29.9,82.8 v29.9,86.1 v29.9,93.8 29.9,97.1
/B2  (via drill 0.4)
  Top 0.305: D8.C v29.2,80.6 | D10.C v29.2,76.2 | D24.C v29.2,92.7 | D35.C v29.2,68.5 | D40.C v29.2,57.5 | D43.C 34.31,50.9 34.3,50.91 v29.21,50.91 v29.2,50.9 25.4,50.9 arc90 23.5,49 23.5,43.81 arc-90 R7.1 R11.1 11.27,41.81 arc90 T3.C
  Bottom 0.305: 29.2,47.5 v29.2,50.9 v29.2,57.5 v29.2,68.5 v29.2,76.2 v29.2,80.6 v29.2,92.7 29.2,97.1
/B3  (via drill 0.4)
  Top 0.305: D3.C v28.5,91.6 | D6.C v28.5,85 | D11.C v28.5,74 | D14.C v28.5,67.4 | D17.C v28.5,60.8 | D29.C v28.5,81.7 | T4.C arc-90 11.27,31.81 R12.1 R8.1 25.96,31.81 arc90 28.5,34.35 v28.5,47.5
  Bottom 0.305: 28.5,97.1 v28.5,91.6 v28.5,85 v28.5,81.7 v28.5,74 v28.5,67.4 v28.5,60.8 28.5,48.6 v28.5,47.5
B0  (via drill 0.4)
  Top 0.305: D4.C v27.8,89.4 | D18.C v27.8,58.6 26.9,58.6 arc-90 26,59.5 arc90 24.96,60.54 T5.C | D26.C v27.8,88.3 | D22.C v27.8,97.1
  Bottom 0.305: 27.8,47.5 v27.8,58.6 v27.8,88.3 v27.8,89.4 v27.8,97.1
B1  (via drill 0.4)
  Top 0.305: D5.C v27.1,87.2 | D9.C v27.1,78.4 | D13.C v27.1,69.6 | D23.C v27.1,94.9 | D30.C v27.1,79.5 | T6.C 22.04,50.54 arc90 23.5,52 arc-90 24.5,53 v27.1,53
  Bottom 0.305: 27.1,47.5 v27.1,53 v27.1,69.6 v27.1,78.4 v27.1,79.5 v27.1,87.2 v27.1,94.9 27.1,97.1
B2  (via drill 0.4)
  Top 0.305: D16.C v26.4,63 | D20.C v26.4,54.2 | D28.C v26.4,83.9 | D31.C v26.4,77.3 | D37.C v26.4,64.1 | T7.C 22.04,40.54 arc90 24.5,43 24.5,48.5 arc-90 26,50 v26.4,50
  Bottom 0.305: 26.4,47.5 v26.4,50 v26.4,54.2 v26.4,63 v26.4,64.1 v26.4,77.3 v26.4,83.9 26.4,97.1
B3  (via drill 0.4)
  Top 0.305: D21.C v25.7,52 | D25.C v25.7,90.5 | D32.C v25.7,75.1 | D41.C v25.7,55.3 | D38.C v25.7,61.9 | D44.C 43.09,48.6 29.5,48.6 | 29.5,48.6 v25.7,48.6 | T8.C 26.96,30.54 arc90 29.5,33.08 29.5,48.6
  Bottom 0.305: 25.7,97.1 v25.7,90.5 v25.7,75.1 v25.7,61.9 v25.7,55.3 v25.7,52 v25.7,48.6 25.7,47.5
GND
  Top 0.61: T13.E T9.E | T10.E T14.E | T11.E T15.E | T12.E 76.2,44.46 arc90 74.93,43.19 74.93,28.27 arc-90 73.66,27 21,27 arc90 20,26 arc-90 19.46,25.46 T8.E
  Bottom 0.61: 12.5,25.5 12.5,26 | 12.5,26 12.5,35.5 | 12.5,35.5 12.5,36 | 12.5,46 12.5,55.5 | T7.E arc90 16.96,36 12.5,36 | T6.E arc90 16.96,46 12.5,46 | T8.E arc90 16.96,26 12.5,26 | T12.E arc-90 83.5,46.46 83.5,54.5 | 83.5,54.5 83.5,67.5 | 83.5,67.5 83.5,80.5 | 83.5,80.5 83.5,97 arc90 81.5,99 13.54,99 arc90 11,96.46 11,74.85 | T11.E 83.54,54.46 arc-90 83.5,54.5 | T10.E 83.54,67.46 arc-90 83.5,67.5 | T13.E 83.54,80.46 arc-90 83.5,80.5 | T3.E arc-90 10.04,35.5 12.5,35.5 | 12.5,36 12.5,45.5 | 12.5,45.5 12.5,46 | T2.E arc-90 10.04,45.5 12.5,45.5 | T1.E arc-90 10.04,55.5 12.5,55.5 | CN1.1 50.8,17.78 50.8,18.23 arc90 49.53,19.5 45.72,19.5 13.77,19.5 arc-90 12.5,20.77 12.5,25.5 | T4.E 12.46,25.46 arc90 12.5,25.5 | 12.5,55.5 12.5,56 | 12.5,56 12.5,63 arc90 10,65.5 9.04,65.5 arc-90 6.5,68.04 6.5,72.31 arc-90 9.04,74.85 11,74.85 | T5.E arc90 16.96,56 12.5,56 | 11,74.85 BT1.2
  pour Bottom: 0,53 0,96 arc-90 4,100 94,100 96,100 arc-90 100,96 100,31 100,4 arc-90 96,0 89,0 4,0 arc-90 0,4
I1  (via drill 0.4)
  Top 0.305: v52.8,96 D1.A | D53.A v52.8,79.5
  Bottom 0.305: D3.A D2.A D1.A | 52.8,97 v52.8,96 v52.8,79.5 52.8,41.27 arc-90 51.53,40 33.27,40 arc90 32,38.73 R27.2
I2  (via drill 0.4)
  Top 0.305: v53.5,89.4 D4.A | D59.A v53.5,66.3 | D54.A v53.5,77.3 | D45.A v53.5,97.1
  Bottom 0.305: D6.A D5.A D4.A | v53.5,97.1 v53.5,89.4 v53.5,77.3 v53.5,66.3 53.5,40.27 arc-90 52.23,39 36.27,39 arc90 35,37.73 R28.2
I3  (via drill 0.4)
  Top 0.305: v54.2,82.8 D7.A | D60.A v54.2,64.1 | D55.A v54.2,75.1
  Bottom 0.305: D8.A D7.A | 54.2,97 v54.2,82.8 v54.2,75.1 v54.2,64.1 54.2,39.27 arc-90 52.93,38 39.27,38 arc90 38,36.73 R29.2
I4  (via drill 0.4)
  Top 0.305: v54.9,78.4 D9.A | D66.A v54.9,50.9 | D56.A 61.89,72.9 | 61.89,72.9 | 61.89,72.9 v54.9,72.9 | v54.9,72.9 | D89.A v54.9,63
  Bottom 0.305: D11.A D10.A D9.A | 54.9,97 v54.9,78.4 v54.9,72.9 v54.9,63 v54.9,50.9 54.9,38.27 arc-90 53.63,37 42.27,37 arc90 41,35.73 R30.2
I5  (via drill 0.4)
  Top 0.305: v55.6,69.6 D13.A | D67.A v55.6,48.7 | D46.A v55.6,94.9 | D74.A v55.6,96
  Bottom 0.305: D14.A D13.A D12.A | 55.6,97 v55.6,96 v55.6,94.9 v55.6,69.6 v55.6,48.7 55.6,37.27 arc-90 54.33,36 45.27,36 arc90 44,34.73 R31.2
I6  (via drill 0.4)
  Top 0.305: D15.A v56.3,65.2 | D61.A 56.3,61.9 v56.3,62 | D81.A v56.3,80.6 | v56.3,60.8 D90.A
  Bottom 0.305: D17.A D16.A D15.A | 56.3,97 v56.3,80.6 v56.3,65.2 v56.3,62 v56.3,60.8 56.3,36.27 arc-90 55.03,35 48.27,35 arc90 47,33.73 R32.2
I7  (via drill 0.4)
  Top 0.305: D68.A v57,46.5 | D57.A v57,70.7 | D75.A v57,93.8 | D18.A v57,58.6 D91.A | D62.A v57,59.7
  Bottom 0.305: D21.A D20.A D19.A D18.A | 57,97 v57,93.8 v57,70.7 v57,59.7 v57,58.6 v57,46.5 57,35.27 arc-90 55.73,34 51,34 arc90 50,33 R33.2
I8  (via drill 0.4)
  Top 0.305: D69.A v57.7,44.3 | D63.A 62.89,57.5 62.88,57.49 v57.7,57.49 v57.7,57.5 | v57.7,78.4 D82.A | D76.A v57.7,91.6 | D92.A v57.7,56.4 | D25.A v57.7,90.5
  Bottom 0.305: 57.7,97 v57.7,91.6 v57.7,90.5 v57.7,78.4 v57.7,57.5 v57.7,56.4 v57.7,44.3 57.7,34.27 arc-90 56.43,33 54.27,33 arc90 53,31.73 R34.2 | D22.A D23.A D24.A D25.A
I9  (via drill 0.4)
  Top 0.305: v58.4,88.3 D26.A | D70.A v58.4,42.1 | D64.A 61.6,55.3 | 61.6,55.3 v58.4,55.3 | D47.A v58.4,92.7 | D83.A v58.4,76.2 | 61.6,55.3 62.7,54.2 D93.A
  Bottom 0.305: 58.4,97 v58.4,92.7 v58.4,88.3 v58.4,76.2 v58.4,55.3 v58.4,42.1 58.4,33.27 arc-90 57.13,32 57,32 arc90 56,31 R35.2 | D26.A D27.A D28.A D29.A
I10  (via drill 0.4)
  Top 0.305: D48.A v59.1,90.5 | D84.A v59.1,74 51.91,74 D32.A | D77.A v59.1,89.4 | D94.A v59.1,52
  Bottom 0.305: 59.1,97 v59.1,90.5 v59.1,89.4 v59.1,74 v59.1,52 59.1,29.91 arc-90 R36.2 | D30.A D31.A D32.A
I11  (via drill 0.4)
  Top 0.305: D71.A v59.8,39.9 | D49.A v59.8,88.3 | D85.A v59.8,71.8 51.91,71.8 D33.A | D78.A v59.8,87.2
  Bottom 0.305: 59.8,97 v59.8,88.3 v59.8,87.2 v59.8,71.8 v59.8,39.9 59.8,32.2 arc90 61,31 arc-90 62,30 R37.2 | D33.A D34.A D35.A
I12  (via drill 0.4)
  Top 0.305: D72.A 60.53,37.73 v60.5,37.7 | D50.A v60.5,86.1 | D86.A v60.5,69.6 | D79.A v60.5,85 | D36.A 53.01,68.5 v60.5,68.5
  Bottom 0.305: 60.5,97 v60.5,86.1 v60.5,85 v60.5,69.6 v60.5,68.5 v60.5,37.7 60.5,33.27 arc90 61.77,32 64,32 arc-90 65,31 R38.2 | D36.A D37.A D38.A
I13  (via drill 0.4)
  Top 0.305: D73.A v61.2,35.5 | D51.A v61.2,83.9 | D87.A v61.2,67.4 | D95.A v61.2,49.8 | D41.A 51.81,54.3 v61.2,54.3
  Bottom 0.305: 61.2,97 v61.2,83.9 v61.2,67.4 v61.2,54.3 v61.2,49.8 v61.2,35.5 61.2,34.27 arc90 62.47,33 66.73,33 arc-90 68,31.73 R39.2 | D39.A D40.A D41.A
I14  (via drill 0.4)
  Top 0.305: D65.A v61.9,53.1 D42.A | D58.A v61.9,68.5 | D52.A 63.69,81.6 v61.9,81.6 | D88.A v61.9,65.2 | D80.A v61.9,82.8 | D96.A v61.9,47.6
  Bottom 0.305: 61.9,52.4 v61.9,53.1 | v61.9,53.1 v61.9,47.6 61.9,34.91 arc90 62.81,34 69.73,34 arc-90 71,32.73 R40.2 | v61.9,53.1 v61.9,65.2 v61.9,68.5 v61.9,81.6 v61.9,82.8 61.9,97 | D42.A D43.A D44.A
IN0
  Top 0.305: R1.1 4.27,54.19 arc90 3,52.92 3,10.27 arc90 4.27,9 6.23,9 arc-90 7.5,7.73 7.5,6.77 arc90 9.27,5 34.5,5 arc90 35.5,6 arc-90 36.5,7 43,7 | CN2.1 58.42,5.72 arc90 57.14,7 43,7 | U$1.2B arc90 43,8.62 43,7
IN1
  Top 0.305: CN2.2 60.96,9.22 arc90 59.68,10.5 35.4,10.5 arc90 34.13,9.23 U$2.2B 34.13,7.27 arc-90 32.86,6 9.77,6 arc-90 8.5,7.27 8.5,8.73 arc90 7.23,10 5.27,10 arc-90 4,11.27 4,42.92 arc-90 5.27,44.19 R2.1
IN2
  Top 0.305: CN2.3 63.5,10.22 arc90 62.22,11.5 26.4,11.5 arc90 25.13,10.23 U$3.2B 25.13,8.27 arc-90 23.86,7 10.77,7 arc-90 9.5,8.27 9.5,9.73 arc90 8.23,11 6.27,11 arc-90 5,12.27 5,32.92 arc-90 6.27,34.19 R3.1
IN3
  Top 0.305: CN2.4 66.04,11.22 arc90 64.76,12.5 16,12.5 | R4.1 6.5,13.77 arc90 7.77,12.5 16,12.5 | U$4.2B arc-90 16,8.88 16,12.5
N$1
  Top 0.305: T9.B 91.27,83 arc-90 90,84.27 90,86.73 arc-90 91.27,88 R13.2
N$2
  Bottom 0.305: CN3.1 86.36,8.57 arc-90 87.63,9.84 95.25,9.84 arc90 96.2,10.79 96.2,26.67 | R20.2 97.47,30.69 arc90 96.2,29.42 96.2,26.67 | DISP1.7 96.15,26.72 arc-90 96.2,26.67
N$3
  Top 0.305: T10.B arc90 88,72.5 88,75.46 arc-90 90.54,78 R14.2
N$4
  Top 0.305: T11.B 85.96,57 arc90 88.5,59.54 88.5,63 arc-90 90.5,65 R15.2
N$5
  Top 0.305: T12.B 89.77,47 arc90 92.81,50.04 R16.2
N$6
  Top 0.305: T13.B 85.96,83 arc90 88.5,85.54 88.5,88.46 arc-90 91.04,91 R17.2
N$7
  Top 0.305: T14.B 90.77,70 arc-90 89.5,71.27 89.5,73.73 arc-90 90.77,75 R18.2
N$8
  Top 0.305: T15.B 91.27,57 arc-90 90,58.27 90,60.73 arc-90 91.27,62 R19.2
N$9
  Top 0.305: DISP1.6 97.58,27.92 arc90 96.5,29 96.19,29 arc-90 R21.2
  Bottom 0.305: 83.82,12.49 83.82,12.46 | 83.82,12.46 CN3.2 | 85.09,13.73 91.44,13.73 92.23,13.73 92.43,13.73 arc90 93.7,15 93.7,15.2 93.7,16.51 93.7,29.89 arc-90 R21.2 | 85.09,13.73 85.06,13.73 | 83.82,12.46 arc-90 85.09,13.73
N$10
  Top 0.305: DISP1.4 95.04,9.77 arc-90 93.77,8.5 82.52,8.5 arc90 81.28,7.26 CN3.3
  Bottom 0.305: R22.2 91.3,30.49 91.3,17.78 91.3,17.07 91.3,16 arc-90 90.03,14.73 88.96,14.73 88.9,14.73 82.55,14.73 | 81.28,13.49 81.28,13.46 | 81.28,13.46 CN3.3 | 82.55,14.73 82.52,14.73 | 81.28,13.46 arc-90 82.55,14.73
N$11
  Top 0.305: CN3.4 78.74,8.26 arc-90 79.98,9.5 88.69,9.5 arc90 89.96,10.77 DISP1.2
  Bottom 0.305: 78.74,14.49 78.74,14.46 | 78.74,14.46 CN3.4 | 80.01,15.73 79.98,15.73 | 78.74,14.46 arc-90 80.01,15.73 | 80.01,15.73 87.23,15.73 arc90 88.74,17.24 88.74,30.45 R23.2
N$12
  Top 0.305: DISP1.1 77.44,11.48 arc90 76.2,10.24 CN3.5
  Bottom 0.305: 76.2,15.49 76.2,15.46 | 76.2,15.46 CN3.5 | 77.47,16.73 82.87,16.73 82.96,16.73 84.23,16.73 arc90 85.5,18 R24.2 | 77.47,16.73 77.44,16.73 | 77.47,16.73 arc90 76.2,15.46
N$13
  Top 0.305: DISP1.9 89.96,27.73 arc90 88.69,29 83.77,29 arc-90 82.5,30.27 R25.2
  Bottom 0.305: CN3.6 73.66,16.49 arc-90 74.9,17.73 81.23,17.73 arc90 82.5,19 R25.2
N$14
  Top 0.305: DISP1.10 80.77,26.72 arc-90 79.5,27.99 R26.2
  Bottom 0.305: CN3.7 71.12,17.18 arc-90 72.36,18.42 78.23,18.42 arc90 79.5,19.69 R26.2
N$16
  Bottom 0.61: J1.3 16.58,92.31 arc90 14.04,94.85 BT1.1
N$22
  Top 0.305: R1.2 6.5,59.27 arc90 7.77,58 T1.B
N$23
  Top 0.305: T2.B 7.77,48 arc-90 6.5,49.27 R2.2
N$24
  Top 0.305: T3.B 7.77,38 arc-90 6.5,39.27 R3.2
N$25
  Top 0.305: T4.B 7.77,28 arc-90 6.5,29.27 R4.2
N$26
  Top 0.305: T8.B 15.27,28 arc90 14,26.73 R12.2
N$27
  Top 0.305: R11.2 14,36.73 arc-90 15.27,38 T7.B
N$28
  Top 0.305: R10.2 14,46.73 arc-90 15.27,48 T6.B
N$29
  Top 0.305: R9.2 14,56.73 arc-90 15.27,58 T5.B
ORA
  Top 0.305: D49.C 84.89,88.3 arc-90 R13.1
  Bottom 0.305: D52.C D51.C D50.C D49.C D48.C D47.C D46.C D45.C
ORB
  Top 0.305: R14.1 arc-90 84.49,77.3 D54.C
  Bottom 0.305: D53.C D54.C D55.C D56.C D57.C D58.C
ORC
  Top 0.305: R15.1 arc-90 84.29,64.1 D60.C
  Bottom 0.305: D59.C D60.C D61.C D62.C D63.C D64.C D65.C
ORD
  Top 0.305: R16.1 arc-90 84.09,50.9 D66.C
  Bottom 0.305: D73.C D72.C D71.C D70.C D69.C D68.C D67.C D66.C
ORE
  Top 0.305: R17.1 arc90 84.59,91.6 D76.C
  Bottom 0.305: D80.C D79.C D78.C D77.C D76.C D75.C D74.C
ORF
  Top 0.305: R18.1 arc90 83.99,76.2 D83.C
  Bottom 0.305: D88.C D87.C D86.C D85.C D84.C D83.C D82.C D81.C
ORG
  Top 0.305: R19.1 arc90 84.19,63 D89.C
  Bottom 0.305: D96.C D95.C D94.C D93.C D92.C D91.C D90.C D89.C
SEGA
  Bottom 0.305: R20.1 arc-90 96.84,38.97 96.84,78.74 arc90 95.57,80.01 95.25,80.01 arc-90 93.98,81.28 93.98,84.27 arc90 92.71,85.54 T9.C
SEGB
  Bottom 0.305: R21.1 94.73,38.31 arc90 96,39.58 96,75.23 arc90 94.73,76.5 91.27,76.5 arc90 90,75.23 90,73.81 arc-90 88.73,72.54 T10.C
SEGC
  Bottom 0.305: T11.C 86.73,59.54 arc90 88.5,61.31 88.5,62.23 arc-90 89.77,63.5 93.33,63.5 arc-90 94.6,62.23 94.6,42.77 arc-90 93.33,41.5 92.77,41.5 arc90 91.5,40.23 R22.1
SEGD
  Bottom 0.305: R23.1 88.5,36.27 arc-90 87.23,35 77.27,35 arc-90 76,36.27 76,41.73 arc-90 77.27,43 86.73,43 arc90 88,44.27 88,48.27 arc90 86.73,49.54 T12.C
SEGE
  Bottom 0.305: R24.1 85.5,38.73 arc-90 86.77,40 89,40 arc-90 90,39 90,36.27 arc90 91.27,35 97.73,35 arc90 99,36.27 99,40.06 arc90 98.42,40.64 arc-90 97.79,41.27 97.79,80.01 arc90 96.52,81.28 96.2,81.28 arc-90 94.93,82.55 94.93,88.27 arc90 93.66,89.53 90.17,89.53 arc90 88.9,88.27 88.9,86.81 arc-90 87.63,85.54 T13.C
SEGF
  Top 0.305: R25.1 82.5,40.73 arc-90 83.77,42 94.23,42 arc90 95.5,43.27 95.5,71.5 arc90 94.46,72.54 T14.C
SEGG
  Bottom 0.305: T15.C 90.67,59.54 arc90 89.4,58.27 89.4,43.27 arc-90 87.53,41.4 80.17,41.4 arc90 79.5,40.73 R26.1
VCC
  Top 0.61: DISP1.3 92.5,18 | 92.5,18 DISP1.8 | R35.1 56,19.27 arc90 57.27,18 92.5,18 | U$4.1A 11.61,3.23 arc-90 12.58,4.2 20.5,4.2 | CN1.2 53.34,3.23 arc90 52.37,4.2 38.3,4.2 | 20.5,4.2 30.2,4.2 | 30.2,4.2 38.3,4.2 | U$3.1A arc-90 20.5,2.36 20.5,4.2 | U$2.1A 29.61,4 30,4 arc-90 30.2,4.2 | U$1.1A 38.61,3.89 38.5,4 arc90 38.3,4.2
  Bottom 0.61: R35.1 R40.1 R39.1 R38.1 R37.1 R36.1 R35.1 | 53.34,22.19 R34.1 R33.1 R32.1 R31.1 R30.1 R29.1 R28.1 R27.1 21.27,22.19 arc-90 20,23.46 20,24.73 | R35.1 54.61,22.19 54.5,22.19 53.34,22.19 | 20,24.73 20,34 | 20,34 20,44 | 20,44 20,54 | R5.2 20.19,54.19 arc90 20,54 | R6.2 20.19,44.19 arc90 20,44 | R7.2 arc-90 21.31,34 20,34 | R8.2 20.54,24.19 arc-90 20,24.73 | 53.34,22.19 CN1.2 53.34,2.27 | 20,54 20,64 arc90 18,66 16.58,66 arc-90 14.04,68.54 J1.2
  pour Top: 0,53 0,96 arc-90 4,100 94,100 96,100 arc-90 100,96 100,31 100,4 arc-90 96,0 89,0 4,0 arc-90 0,4

### Text on the board
tPlace: VCC | VCC | GND | GND | On | Off | 8 | 4 | 2 | 1 | Hex in | Segment | GND | VCC | 0 | 1 | 2 | 3 | G | F | E | D | C | B | A